# Altium schematic sheet 04-ETHERNET.SchDoc
size A3
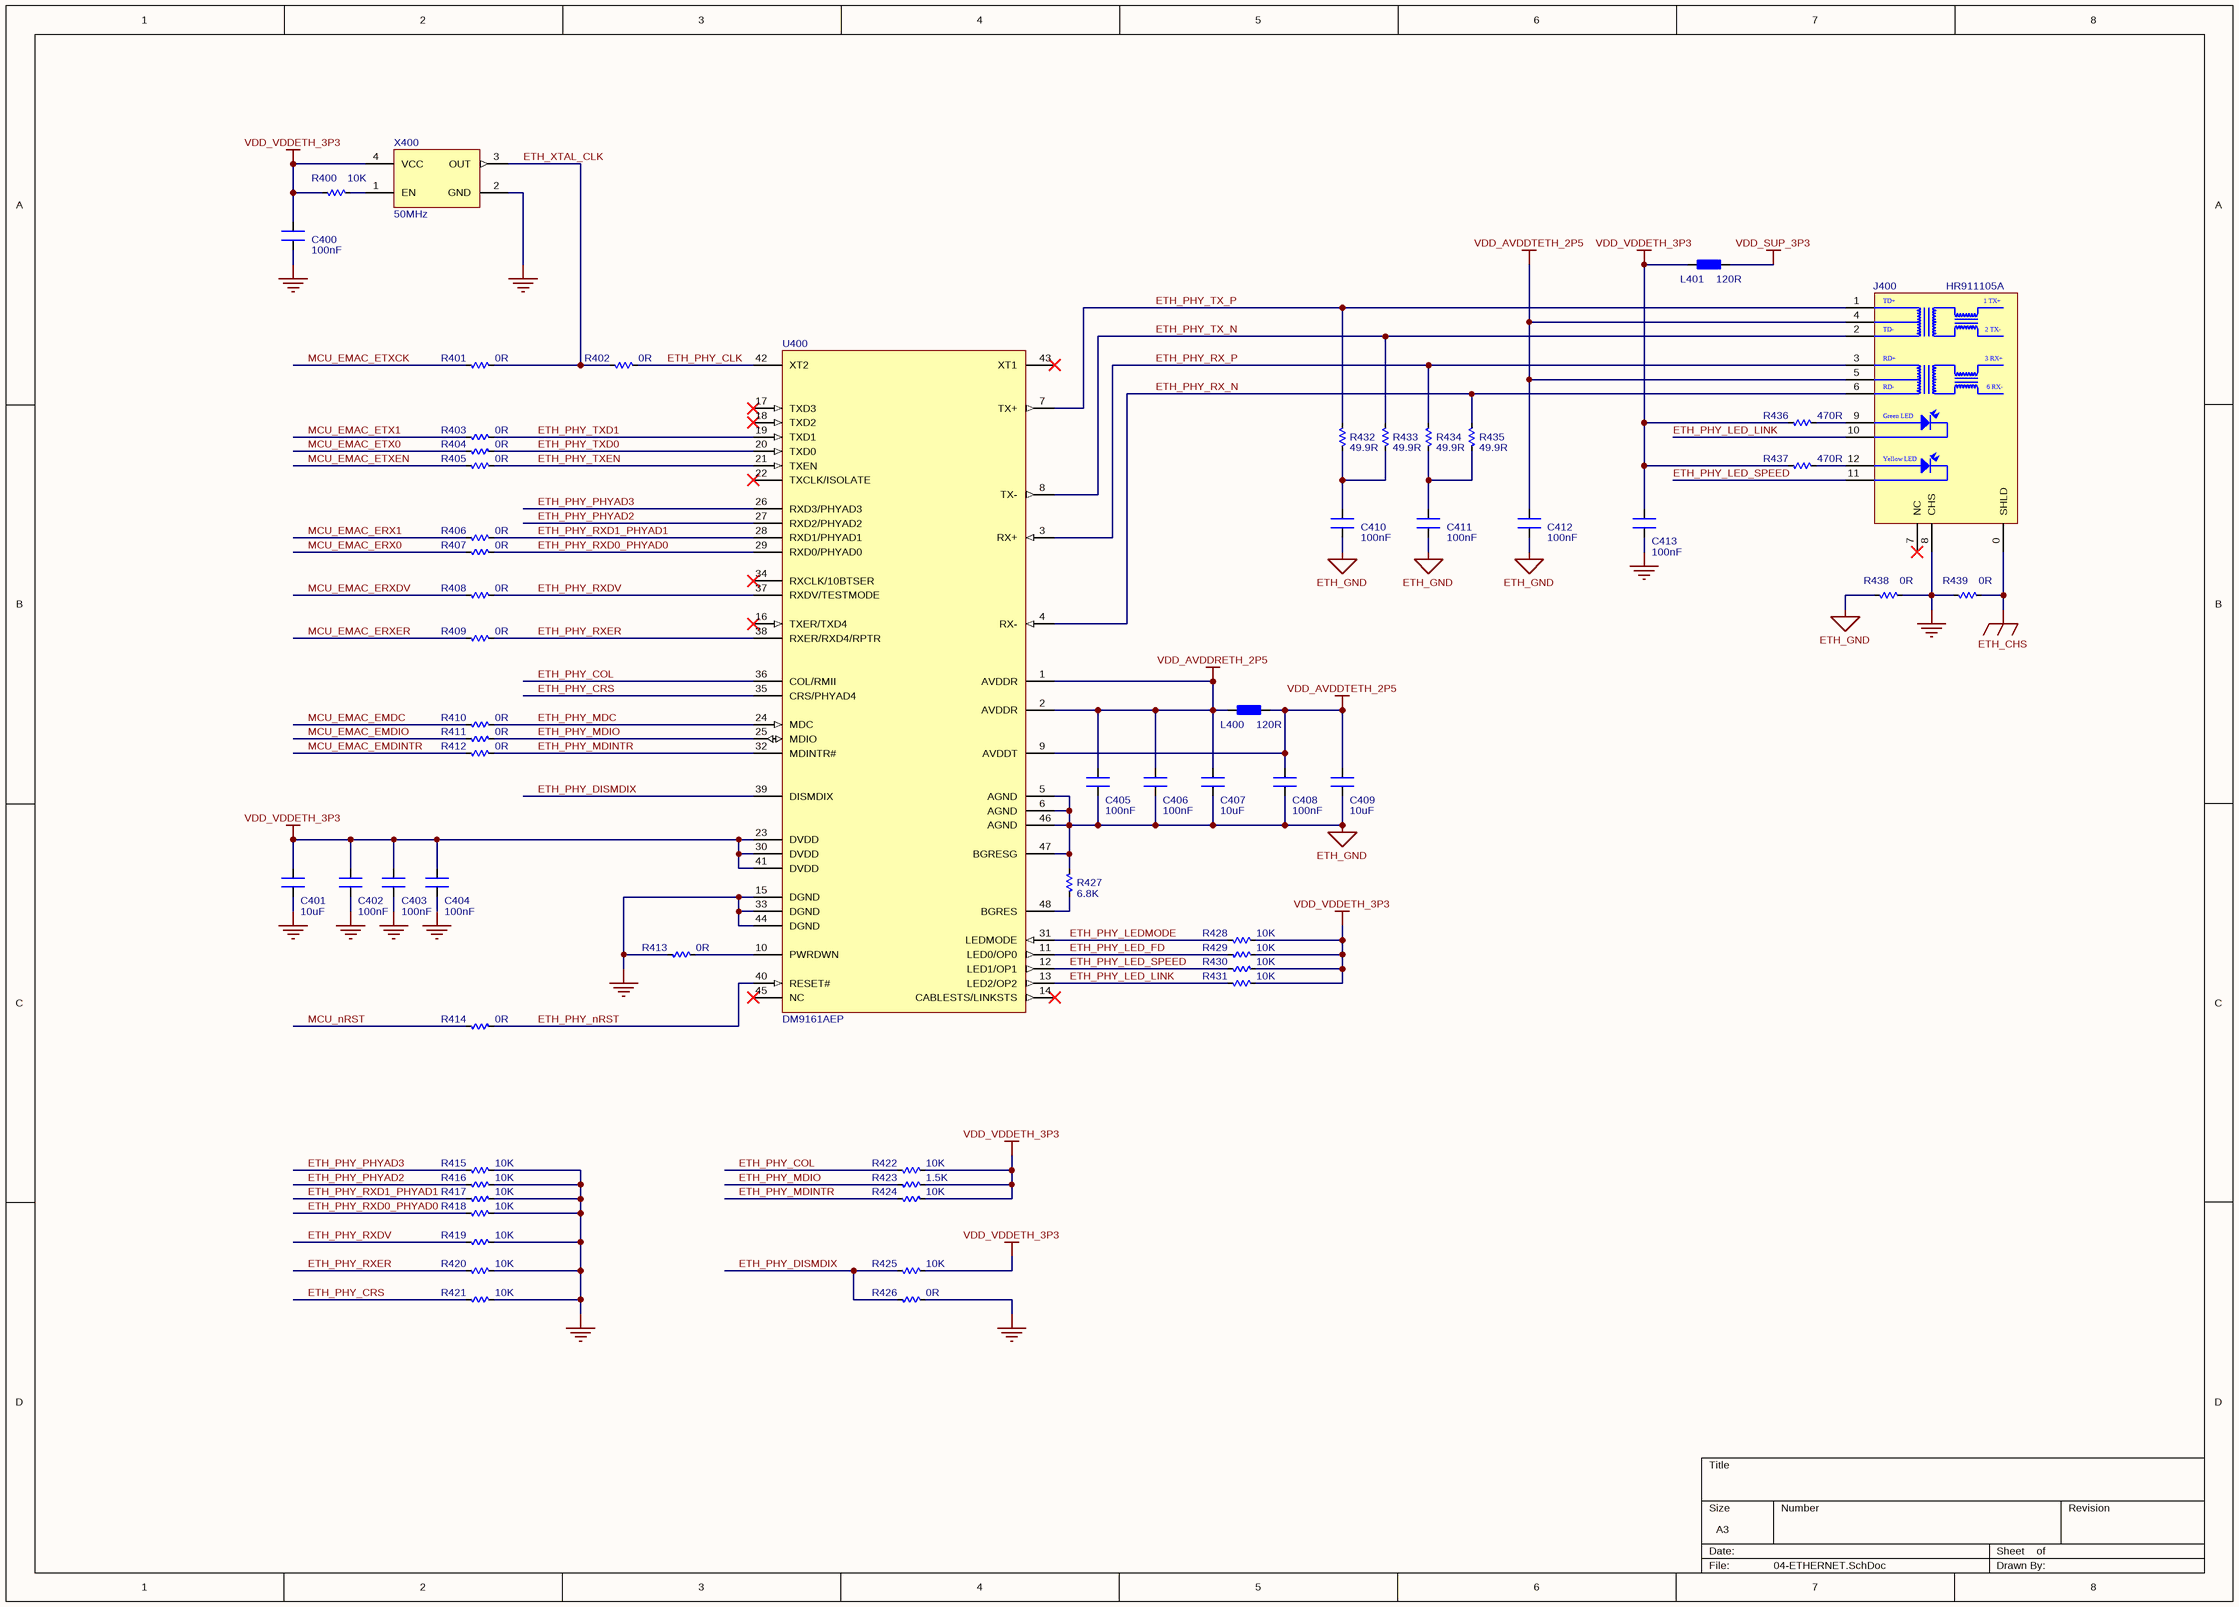
[diagram p0: 04-ETHERNET.SchDoc]

## Parts
C400  value 100nF  [CN-SMD-0603]  (hidden comment: Capacitor)
C401  value 10uF  [CN-SMD-0603]  (hidden comment: Capacitor)
C402  value 100nF  [CN-SMD-0603]  (hidden comment: Capacitor)
C403  value 100nF  [CN-SMD-0603]  (hidden comment: Capacitor)
C404  value 100nF  [CN-SMD-0603]  (hidden comment: Capacitor)
C405  value 100nF  [CN-SMD-0603]  (hidden comment: Capacitor)
C406  value 100nF  [CN-SMD-0603]  (hidden comment: Capacitor)
C407  value 10uF  [CN-SMD-0603]  (hidden comment: Capacitor)
C408  value 100nF  [CN-SMD-0603]  (hidden comment: Capacitor)
C409  value 10uF  [CN-SMD-0603]  (hidden comment: Capacitor)
C410  value 100nF  [CN-SMD-0603]  (hidden comment: Capacitor)
C411  value 100nF  [CN-SMD-0603]  (hidden comment: Capacitor)
C412  value 100nF  [CN-SMD-0603]  (hidden comment: Capacitor)
C413  value 100nF  [CN-SMD-0603]  (hidden comment: Capacitor)
J400  HR911105A  [RJ-45_HR911105A]
L400  value 120R  [L-SMD-0603]  (hidden comment: Ferrite bead)
L401  value 120R  [L-SMD-0603]  (hidden comment: Ferrite bead)
R400  value 10K  [RES-SMD-0603]  (hidden comment: Resistor)
R401  value 0R  [RES-SMD-0603]  (hidden comment: Resistor)
R402  value 0R  [RES-SMD-0603]  (hidden comment: Resistor)
R403  value 0R  [RES-SMD-0603]  (hidden comment: Resistor)
R404  value 0R  [RES-SMD-0603]  (hidden comment: Resistor)
R405  value 0R  [RES-SMD-0603]  (hidden comment: Resistor)
R406  value 0R  [RES-SMD-0603]  (hidden comment: Resistor)
R407  value 0R  [RES-SMD-0603]  (hidden comment: Resistor)
R408  value 0R  [RES-SMD-0603]  (hidden comment: Resistor)
R409  value 0R  [RES-SMD-0603]  (hidden comment: Resistor)
R410  value 0R  [RES-SMD-0603]  (hidden comment: Resistor)
R411  value 0R  [RES-SMD-0603]  (hidden comment: Resistor)
R412  value 0R  [RES-SMD-0603]  (hidden comment: Resistor)
R413  value 0R  [RES-SMD-0603]  (hidden comment: Resistor)
R414  value 0R  [RES-SMD-0603]  (hidden comment: Resistor)
R415  value 10K  [RES-SMD-0603]  (hidden comment: Resistor)
R416  value 10K  [RES-SMD-0603]  (hidden comment: Resistor)
R417  value 10K  [RES-SMD-0603]  (hidden comment: Resistor)
R418  value 10K  [RES-SMD-0603]  (hidden comment: Resistor)
R419  value 10K  [RES-SMD-0603]  (hidden comment: Resistor)
R420  value 10K  [RES-SMD-0603]  (hidden comment: Resistor)
R421  value 10K  [RES-SMD-0603]  (hidden comment: Resistor)
R422  value 10K  [RES-SMD-0603]  (hidden comment: Resistor)
R423  value 1.5K  [RES-SMD-0603]  (hidden comment: Resistor)
R424  value 10K  [RES-SMD-0603]  (hidden comment: Resistor)
R425  value 10K  [RES-SMD-0603]  (hidden comment: Resistor)
R426  value 0R  [RES-SMD-0603]  (hidden comment: Resistor)
R427  value 6.8K  [RES-SMD-0603]  (hidden comment: Resistor)
R428  value 10K  [RES-SMD-0603]  (hidden comment: Resistor)
R429  value 10K  [RES-SMD-0603]  (hidden comment: Resistor)
R430  value 10K  [RES-SMD-0603]  (hidden comment: Resistor)
R431  value 10K  [RES-SMD-0603]  (hidden comment: Resistor)
R432  value 49.9R  [RES-SMD-0603]  (hidden comment: Resistor)
R433  value 49.9R  [RES-SMD-0603]  (hidden comment: Resistor)
R434  value 49.9R  [RES-SMD-0603]  (hidden comment: Resistor)
R435  value 49.9R  [RES-SMD-0603]  (hidden comment: Resistor)
R436  value 470R  [RES-SMD-0603]  (hidden comment: Resistor)
R437  value 470R  [RES-SMD-0603]  (hidden comment: Resistor)
R438  value 0R  [RES-SMD-0603]  (hidden comment: Resistor)
R439  value 0R  [RES-SMD-1206]  (hidden comment: Resistor)
U400  DM9161AEP  [LQFP50P900X900X160-48N]
X400  50MHz  [XT-SMD-3225-4P]

## Nets
ETH_CHS: J400.0(SHLD) R439.1
ETH_GND: C405.1 C406.1 C407.1 C408.1 C409.1 C410.1 C411.1 C412.1 R427.1 R438.2 U400.5(AGND) U400.6(AGND) U400.46(AGND) U400.47(BGRESG)
GND: C400.1 C401.1 C402.1 C403.1 C404.1 C413.1 J400.8(CHS) R413.2 R415.1 R416.1 R417.1 R418.1 R419.1 R420.1 R421.1 R426.1 R438.1 R439.2 U400.15(DGND) U400.33(DGND) U400.44(DGND) X400.2(GND)
VDD_AVDDRETH_2P5: C405.2 C406.2 C407.2 L400.2 U400.1(AVDDR) U400.2(AVDDR)
VDD_AVDDTETH_2P5: C408.2 C409.2 C412.2 J400.4(2,5V) J400.5(2,5V) L400.1 U400.9(AVDDT)
VDD_SUP_3P3: L401.2
VDD_VDDETH_3P3: C400.2 C401.2 C402.2 C403.2 C404.2 C413.2 L401.1 R400.2 R422.1 R423.1 R424.1 R425.1 R428.1 R429.1 R430.1 R431.1 R436.2 R437.2 U400.23(DVDD) U400.30(DVDD) U400.41(DVDD) X400.4(VCC)
ETH_PHY_CLK: R402.1 U400.42(XT2)
ETH_PHY_COL: R422.2 U400.36(COL/RMII)
ETH_PHY_CRS: R421.2 U400.35(CRS/PHYAD4)
ETH_PHY_DISMDIX: R425.2 R426.2 U400.39(DISMDIX)
ETH_PHY_LED_FD: R429.2 U400.11(LED0/OP0)
ETH_PHY_LED_LINK: J400.10(Green-) R431.2 U400.13(LED2/OP2)
ETH_PHY_LED_SPEED: J400.11(Yellow-) R430.2 U400.12(LED1/OP1)
ETH_PHY_LEDMODE: R428.2 U400.31(LEDMODE)
ETH_PHY_MDC: R410.1 U400.24(MDC)
ETH_PHY_MDINTR: R412.1 R424.2 U400.32(MDINTR#)
ETH_PHY_MDIO: R411.1 R423.2 U400.25(MDIO)
ETH_PHY_nRST: R414.1 U400.40(RESET#)
ETH_PHY_PHYAD2: R416.2 U400.27(RXD2/PHYAD2)
ETH_PHY_PHYAD3: R415.2 U400.26(RXD3/PHYAD3)
ETH_PHY_RX_N: J400.6(RD-) R435.1 U400.4(RX-)
ETH_PHY_RX_P: J400.3(RD+) R434.1 U400.3(RX+)
ETH_PHY_RXD0_PHYAD0: R407.1 R418.2 U400.29(RXD0/PHYAD0)
ETH_PHY_RXD1_PHYAD1: R406.1 R417.2 U400.28(RXD1/PHYAD1)
ETH_PHY_RXDV: R408.1 R419.2 U400.37(RXDV/TESTMODE)
ETH_PHY_RXER: R409.1 R420.2 U400.38(RXER/RXD4/RPTR)
ETH_PHY_TX_N: J400.2(TD-) R433.1 U400.8(TX-)
ETH_PHY_TX_P: J400.1(TD+) R432.1 U400.7(TX+)
ETH_PHY_TXD0: R404.1 U400.20(TXD0)
ETH_PHY_TXD1: R403.1 U400.19(TXD1)
ETH_PHY_TXEN: R405.1 U400.21(TXEN)
ETH_XTAL_CLK: R401.1 R402.2 X400.3(OUT)
MCU_EMAC_EMDC: R410.2
MCU_EMAC_EMDINTR: R412.2
MCU_EMAC_EMDIO: R411.2
MCU_EMAC_ERX0: R407.2
MCU_EMAC_ERX1: R406.2
MCU_EMAC_ERXDV: R408.2
MCU_EMAC_ERXER: R409.2
MCU_EMAC_ETX0: R404.2
MCU_EMAC_ETX1: R403.2
MCU_EMAC_ETXCK: R401.2
MCU_EMAC_ETXEN: R405.2
MCU_nRST: R414.2
NetC410_2: C410.2 R432.2 R433.2
NetC411_2: C411.2 R434.2 R435.2
NetJ400_9: J400.9(Green+) R436.1
NetJ400_12: J400.12(Yellow+) R437.1
NetR400_1: R400.1 X400.1(EN)
NetR413_1: R413.1 U400.10(PWRDWN)
NetR427_2: R427.2 U400.48(BGRES)

Not connected (* = marked no-connect by the designer): J400 7(NC)*; U400 14(CABLESTS/LINKSTS)* 16(TXER/TXD4)* 17(TXD3)* 18(TXD2)* 22(TXCLK/ISOLATE)* 34(RXCLK/10BTSER)* 43(XT1)* 45(NC)*

## Notes on the sheet
- (in symbol HR911105A) 1 TX+; 2 TX-; 3 RX+; 6 RX-; Green LED; Yellow LED

## Library data of the parts
C400 C402-C406 C408 C410-C413 = Cap: Ceramic Capacitor SMD 0603 100nF ±20% 10V
C401 C407 C409 = Cap: Ceramic Capacitor SMD 0603 10uF ±20% 10V
J400 = HR911105A: Single port RJ45 Connector with Integrated Magnetics and LED for 10/100-BaseTX NIC Applications
L400 L401 = Ferrite bead: Ferrite bead SMD 0603 120 Ohm @100MHz
R400 R415-R422 R424 R425 R428-R431 = Res: Resistor SMD 0603 10K 1% 0.1W
R401-R414 R426 R438 = Res: Resistor SMD 0603 0R 1% 0.1W
R423 = Res: Resistor SMD 0603 1.5K 1% 0.1W
R427 = Res: Resistor SMD 0603 6.8K 1% 0.1W
R432-R435 = Res: Resistor SMD 0603 49.9R 1% 0.1W
R436 R437 = Res: Resistor SMD 0603 470R 1% 0.1W
R439 = Res: Resistor SMD 1206 0R 1% 0.5W
U400 = DM9161AEP: DAVICOM 10/100Mbps Fast Ethernet Physical Layer Single Chip Transceiver
X400 = XT4_2: Crystal Oscillator SMD3225 4-pin